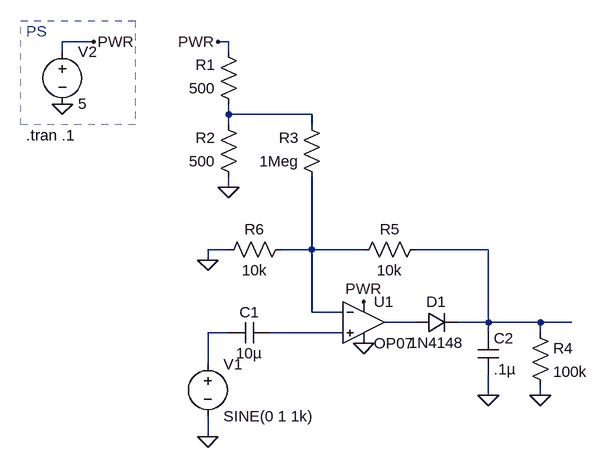
[diagram p0: schematic Draft2.asc]
Draft2.asc, the LTspice schematic file:
Version 4
SHEET 1 880 680
WIRE -272 -368 -320 -368
WIRE -64 -368 -80 -368
WIRE -320 -352 -320 -368
WIRE -64 -352 -64 -368
WIRE -64 -256 -64 -272
WIRE 64 -256 -64 -256
WIRE -64 -240 -64 -256
WIRE 64 -240 64 -256
WIRE -64 -144 -64 -160
WIRE -64 -48 -96 -48
WIRE 64 -48 64 -160
WIRE 64 -48 16 -48
WIRE 144 -48 64 -48
WIRE 336 -48 224 -48
WIRE -96 -32 -96 -48
WIRE 64 48 64 -48
WIRE 112 48 64 48
WIRE 224 64 176 64
WIRE 336 64 336 -48
WIRE 336 64 288 64
WIRE 416 64 336 64
WIRE 464 64 416 64
WIRE -64 80 -96 80
WIRE 112 80 0 80
WIRE 336 80 336 64
WIRE 416 80 416 64
WIRE -96 128 -96 80
WIRE 336 176 336 144
WIRE 416 176 416 160
WIRE -96 240 -96 208
FLAG -96 240 0
FLAG -320 -272 0
FLAG -272 -368 PWR
FLAG -80 -368 PWR
FLAG -64 -144 0
FLAG 336 176 0
FLAG 416 176 0
FLAG 144 32 PWR
FLAG 144 96 0
FLAG -96 -32 0
SYMBOL voltage -96 112 R0
WINDOW 123 0 0 Left 0
WINDOW 39 0 0 Left 0
SYMATTR InstName V1
SYMATTR Value SINE(0 1 1k)
SYMBOL voltage -320 -368 R0
SYMATTR InstName V2
SYMATTR Value 5
SYMBOL res -48 -256 R180
WINDOW 0 36 76 Left 2
WINDOW 3 36 40 Left 2
SYMATTR InstName R1
SYMATTR Value 500
SYMBOL res -48 -144 R180
WINDOW 0 36 76 Left 2
WINDOW 3 36 40 Left 2
SYMATTR InstName R2
SYMATTR Value 500
SYMBOL cap 0 64 R90
WINDOW 0 0 32 VBottom 2
WINDOW 3 32 32 VTop 2
SYMATTR InstName C1
SYMATTR Value 10µ
SYMBOL res 80 -144 R180
WINDOW 0 36 76 Left 2
WINDOW 3 36 40 Left 2
SYMATTR InstName R3
SYMATTR Value 1Meg
SYMBOL diode 224 80 R270
WINDOW 0 32 32 VTop 2
WINDOW 3 0 32 VBottom 2
SYMATTR InstName D1
SYMATTR Value 1N4148
SYMBOL cap 320 144 M180
WINDOW 0 24 56 Left 2
WINDOW 3 24 8 Left 2
SYMATTR InstName C2
SYMATTR Value .1µ
SYMBOL res 400 64 R0
SYMATTR InstName R4
SYMATTR Value 100k
SYMBOL OpAmps\\OP07 144 0 R0
SYMATTR InstName U1
SYMBOL res 240 -64 R90
WINDOW 0 0 56 VBottom 2
WINDOW 3 32 56 VTop 2
SYMATTR InstName R5
SYMATTR Value 10k
SYMBOL res 32 -64 R90
WINDOW 0 0 56 VBottom 2
WINDOW 3 32 56 VTop 2
SYMATTR InstName R6
SYMATTR Value 10k
TEXT -376 -224 Left 2 !.tran .1
TEXT -376 -384 Left 2 ;PS
RECTANGLE Normal -208 -240 -384 -400 2

The netlist it stands for:
* Draft2.asc
V1 N005 0 SINE(0 1 1k)
V2 PWR 0 5
R1 N001 PWR 500
R2 0 N001 500
C1 N006 N005 10µ
R3 N002 N001 1Meg
D1 N004 N003 1N4148
C2 0 N003 .1µ
R4 N003 0 100k
XU1 N006 N002 PWR 0 N004 LT1001  ; OP07, pins In+ In- V+ V- OUT
R5 N003 N002 10k
R6 N002 0 10k
.model D D
.lib standard.dio
.tran .1
* PS
.lib LTC.lib
.backanno
.end